# EAGLE design Maggie-BASIC-TOP (EAGLE 9.6.2)
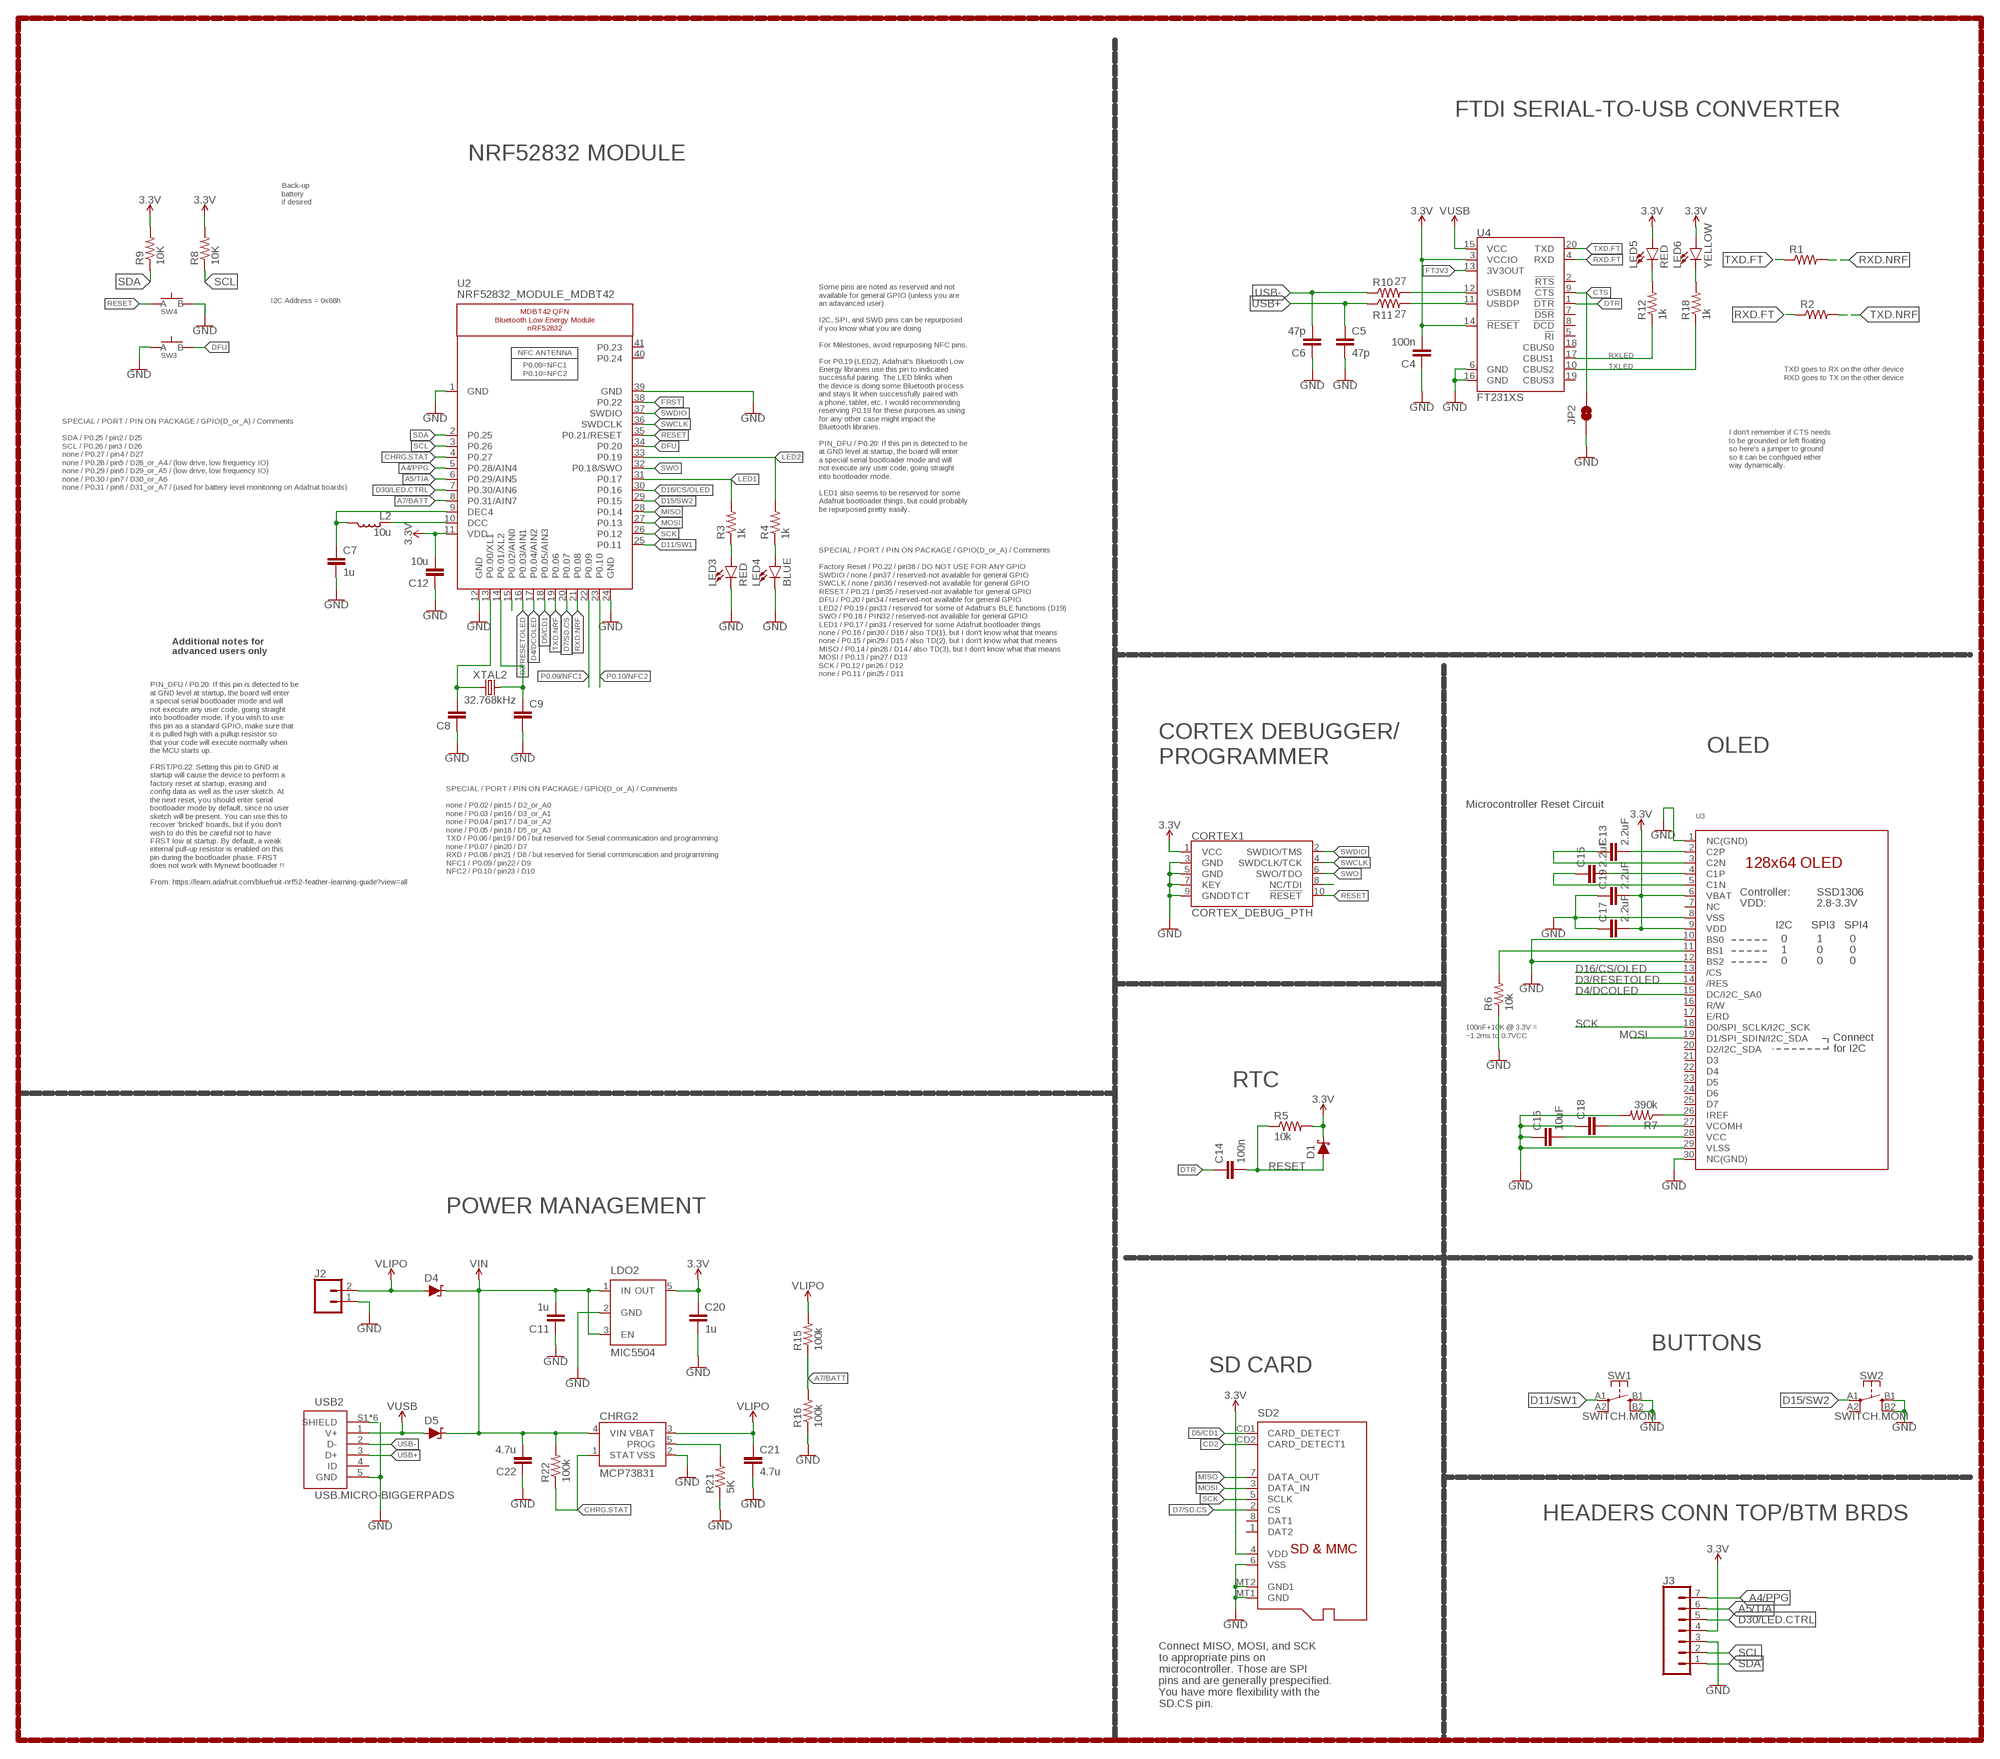
[diagram p0: schematic, sheet 1]

## Parts
C4  100n  CAPACITOR0603  [C0603]
C5  47p  CAPACITOR0603  [C0603]
C6  47p  CAPACITOR0603  [C0603]
C7  1u  CAPACITOR0603  [C0603]
C8  CAPACITOR0603  [C0603]
C9  CAPACITOR0603  [C0603]
C11  1u  CAPACITOR0603  [C0603]
C12  10u  CAPACITOR0805  [C0805]
C13  2.2uF  CAPACITOR0402  [C0402]
C14  100n  CAPACITOR0603  [C0603]
C15  2.2uF  CAPACITOR0402  [C0402]
C16  10uF  CAPACITOR0603  [C0603]
C17  2.2uF  CAPACITOR0402  [C0402]
C18  CAPACITOR0603  [C0603]
C19  2.2uF  CAPACITOR0402  [C0402]
C20  1u  CAPACITOR0603  [C0603]
C21  4.7u  CAPACITOR0603  [C0603]
C22  4.7u  CAPACITOR0603  [C0603]
CHRG2  MCP73831  [SOT23-5]
CORTEX1  CORTEX_DEBUG_PTH  [2X5-PTH-1.27MM]
D1  SCHOTTKY-USC  [USC]
D4  SCHOTTKY-USC  [USC]
D5  SCHOTTKY-USC  [USC]
J2  CONN_02  [1X02]
J3  CONN_07-1.27MM  [1X07_1.27MM]
JP2  JUMPER-SMT_2_NO_SILK  [SMT-JUMPER_2_NO_SILK]
L2  10u  INDUCTOR0603  [L0603]
LDO2  MIC5504  [SOT23-5]
LED3  RED  LED0603  [LED-0603]
LED4  BLUE  LED0603  [LED-0603]
LED5  RED  LED0603  [LED-0603]
LED6  YELLOW  LED0603  [LED-0603]
R1  RESISTOR0603  [R0603]
R2  RESISTOR0603  [R0603]
R3  1k  RESISTOR0603  [R0603]
R4  1k  RESISTOR0603  [R0603]
R5  10k  RESISTOR0603  [R0603]
R6  10k  RESISTOR0603  [R0603]
R7  390k  RESISTOR0603  [R0603]
R8  10K  RESISTOR0603  [R0603]
R9  10K  RESISTOR0603  [R0603]
R10  27  RESISTOR0603  [R0603]
R11  27  RESISTOR0603  [R0603]
R12  1k  RESISTOR0603  [R0603]
R15  100k  RESISTOR0603  [R0603]
R16  100k  RESISTOR0603  [R0603]
R18  1k  RESISTOR0603  [R0603]
R21  5K  RESISTOR0603  [R0603]
R22  100k  RESISTOR0603  [R0603]
SD2  MICROSD  [MICROSD]
SW1  SWITCH.MOM  [TACTILE_SWITCH_SMD_6.2MM_TALL]
SW2  SWITCH.MOM  [TACTILE_SWITCH_SMD_6.2MM_TALL]
SW3  SPST-PTS830GG140-COPY.1-3  [BUTTON-GULLWING]
SW4  SPST-PTS830GG140-COPY.1-3  [BUTTON-GULLWING]
U2  NRF52832_MODULE_MDBT42  [BLE_MODULE_RAYTAC_MDBT42]
U3  DISP_OLED_UG-2864HSWEG01-NO-WRAPAROUND  [UG-2864HSWEG01_0.96IN_NO-WRAPAROUND]
U4  FT231XS  [SSOP20_L]
USB2  USB.MICRO-BIGGERPADS  [USB-MICRO-01.BIGGERPADS]
XTAL2  32.768kHz  CRYSTALECS-.327-12.5-12-C-TR  [2-SMD.NOLEAD.2.0MMTO1.2MM]

## Nets
3.3: C4.2 C12.2 C17.2 C19.2 CORTEX1.1(VCC) D1.-(C) LED5.A LED6.A R5.2 R8.2 R9.2 SD2.4(VDD) U2.11(VDD) U3.6(VBAT) U3.9(VDD) U4.3(VCCIO) U4.14(!RESET) ; supply symbol labelled 3.3V
3.3V: C20.1 J3.4 LDO2.5(OUT)
A4/PPG: J3.7 U2.5(P0.28/AIN4)
A5/TIA: J3.6 U2.6(P0.29/AIN5)
A7/BATT: R15.1 R16.2 U2.8(P0.31/AIN7)
CD2: SD2.CD2(CARD_DETECT1)
CHRG.STAT: CHRG2.1(STAT) R22.1 U2.4(P0.27)
CTS: JP2.2 U4.9(!CTS)
D3/RESETOLED: U2.16(P0.03/AIN1) U3.14(/RES)
D4/DCOLED: U2.17(P0.04/AIN2) U3.15(DC/I2C_SA0)
D5/CD1: SD2.CD1(CARD_DETECT) U2.18(P0.05/AIN3)
D7/SD.CS: SD2.2(CS) U2.20(P0.07)
D11/SW1: SW1.A1 U2.25(P0.11)
D15/SW2: SW2.A1 U2.29(P0.15)
D16/CS/OLED: U2.30(P0.16) U3.13(/CS)
D30/LED.CTRL: J3.5 U2.7(P0.30/AIN6)
DFU: SW3.3(B) U2.34(P0.20)
DTR: C14.1 U4.1(!DTR)
FRST: U2.38(P0.22)
FT3V3: U4.13(3V3OUT)
GND: C4.1 C5.2 C6.1 C7.2 C8.1 C9.2 C11.1 C12.1 C16.1 C17.1 C18.1 C19.1 C20.2 C21.2 C22.1 CHRG2.2(VSS) CORTEX1.3(GND) CORTEX1.5(GND) CORTEX1.7(KEY) CORTEX1.9(GNDDTCT) J2.1 J3.3 JP2.1 LDO2.2(GND) LED3.C LED4.C R6.1 R7.2 R16.1 R21.1 SD2.6(VSS) SD2.MT1(GND) SD2.MT2(GND1) SW1.B1 SW1.B2 SW2.B1 SW2.B2 SW3.1(A) SW4.3(B) U2.1(GND) U2.12(GND) U2.24(GND) U2.39(GND) U3.1(NC(GND)) U3.8(VSS) U3.10(BS0) U3.12(BS2) U3.29(VLSS) U3.30(NC(GND)) U4.6(GND) U4.16(GND) USB2.5(GND) USB2.S1(SHIELD) USB2.S2(SHIELD) USB2.S3(SHIELD) USB2.S4(SHIELD) USB2.S5(SHIELD) USB2.S6(SHIELD)
LED1: R3.2 U2.31(P0.17)
LED2: R4.2 U2.33(P0.19)
MISO: SD2.7(DATA_OUT) U2.28(P0.14)
MOSI: SD2.3(DATA_IN) U2.27(P0.13) U3.19(D1/SPI_SDIN/I2C_SDA)
N$1: R6.2 U3.11(BS1)
N$2: R7.1 U3.26(IREF)
N$3: C13.2 U3.2(C2P)
N$4: C8.2 U2.13(P0.00/XL1) XTAL2.P$1
N$5: C13.1 U3.3(C2N)
N$6: C9.1 U2.14(P0.01/XL2) XTAL2.P$2
N$7: C15.2 U3.4(C1P)
N$8: C15.1 U3.5(C1N)
N$9: LED3.A R3.1
N$10: LED4.A R4.1
N$11: L2.1 U2.10(DCC)
N$12: C7.1 L2.2 U2.9(DEC4)
N$13: C16.2 U3.28(VCC)
N$14: CORTEX1.8(NC/TDI)
N$15: C18.2 U3.27(VCOMH)
N$17: CHRG2.5(PROG) R21.2
N$20: U2.15(P0.02/AIN0)
N$23: R10.2 U4.12(USBDM)
N$24: R11.2 U4.11(USBDP)
N$25: LED5.C R12.2
N$26: LED6.C R18.2
P0.09/NFC1: U2.22(P0.09)
P0.10/NFC2: U2.23(P0.10)
RESET: C14.2 CORTEX1.10(!RESET) D1.+(A) R5.1 SW4.1(A) U2.35(P0.21/RESET)
RXD.FT: R2.1 U4.4(RXD)
RXD.NRF: R1.2 U2.21(P0.08)
RXLED: R12.1 U4.17(CBUS1)
SCK: SD2.5(SCLK) U2.26(P0.12) U3.18(D0/SPI_SCLK/I2C_SCK)
SCL: J3.2 R8.1 U2.3(P0.26)
SDA: J3.1 R9.1 U2.2(P0.25)
SWCLK: CORTEX1.4(SWDCLK/TCK) U2.36(SWDCLK)
SWDIO: CORTEX1.2(SWDIO/TMS) U2.37(SWDIO)
SWO: CORTEX1.6(SWO/TDO) U2.32(P0.18/SWO)
TXD.FT: R1.1 U4.20(TXD)
TXD.NRF: R2.2 U2.19(P0.06)
TXLED: R18.1 U4.10(CBUS2)
USB+: C5.1 R11.1 USB2.3(D+)
USB-: C6.2 R10.1 USB2.2(D-)
V_USB: D5.+(A) U4.15(VCC) USB2.1(V+) ; supply symbol labelled VUSB
VIN: C11.2 C22.2 CHRG2.4(VIN) D4.-(C) D5.-(C) LDO2.1(IN) LDO2.3(EN) R22.2
VLIPO: C21.1 CHRG2.3(VBAT) D4.+(A) J2.2 R15.2
Unconnected: SD2.1(DAT2) SD2.8(DAT1) SW1.A2 SW2.A2 U2.40(P0.24) U2.41(P0.23) U3.7(NC) U3.16(R/W) U3.17(E/RD) U3.20(D2/I2C_SDA) U3.21(D3) U3.22(D4) U3.23(D5) U3.24(D6) U3.25(D7) U4.2(!RTS) U4.5(!RI) U4.7(!DSR) U4.8(!DCD) U4.18(CBUS0) U4.19(CBUS3) USB2.4(ID)

## Notes on the sheet
- FTDI SERIAL-TO-USB CONVERTER
- NRF52832 MODULE
- Back-up
  battery
  if desired
- I2C Address = 0x68h
- TXD goes to RX on the other device
  RXD goes to TX on the other device
- I don't remember if CTS needs
  to be grounded or left floating
  so here's a jumper to ground
  so it can be configued either
  way dynamically.
- SPECIAL / PORT / PIN ON PACKAGE / GPIO(D_or_A) / Comments
  
  SDA / P0.25 / pin2 / D25
  SCL / P0.26 / pin3 / D26
  none / P0.27 / pin4 / D27
  none / P0.28 / pin5 / D28_or_A4 / (low drive, low frequency IO)
  none / P0.29 / pin6 / D29_or_A5 / (low drive, low frequency IO)
  none / P0.30 / pin7 / D30_or_A6
  none / P0.31 / pin8 / D31_or_A7 / (used for battery level monitoring on Adafruit boards)
- Some pins are noted as reserved and not
  available for general GPIO (unless you are
  an adavanced user)
  
  I2C, SPI, and SWD pins can be repurposed
  if you know what you are doing
  
  For Milestones, avoid repurposing NFC pins.
  
  For P0.19 (LED2), Adafruit's Bluetooth Low
  Energy libraries use this pin to indicated
  successful pairing. The LED blinks when
  the device is doing some Bluetooth process
  and stays lit when successfully paired with
  a phone, tablet, etc. I would recommending
  reserving P0.19 for these purposes as using
  for any other case might impact the
  Bluetooth libraries.
  
  PIN_DFU / P0.20: If this pin is detected to be
  at GND level at startup, the board will enter
  a special serial bootloader mode and will
  not execute any user code, going straight
  into bootloader mode.
  
  LED1 also seems to be reserved for some
  Adafruit bootloader things, but could probably
  be repurposed pretty easily.
- Additional notes for
  advanced users only
- SPECIAL / PORT / PIN ON PACKAGE / GPIO(D_or_A) / Comments
  
  Factory Reset / P0.22 / pin38 / DO NOT USE FOR ANY GPIO
  SWDIO / none / pin37 / reserved-not available for general GPIO
  SWCLK / none / pin36 / reserved-not available for general GPIO
  RESET / P0.21 / pin35 / reserved-not available for general GPIO
  DFU / P0.20 / pin34 / reserved-not available for general GPIO
  LED2 / P0.19 / pin33 / reserved for some of Adafruit's BLE functions (D19)
  SWO / P0.18 / PIN32 / reserved-not available for general GPIO
  LED1 / P0.17 / pin31 / reserved for some Adafruit bootloader things
  none / P0.16 / pin30 / D16 / also TD(1), but I don't know what that means
  none / P0.15 / pin29 / D15 / also TD(2), but I don't know what that means
  MISO / P0.14 / pin28 / D14 / also TD(3), but I don't know what that means
  MOSI / P0.13 / pin27 / D13
  SCK / P0.12 / pin26 / D12
  none / P0.11 / pin25 / D11
- OLED
- CORTEX DEBUGGER/
  PROGRAMMER
- Microcontroller Reset Circuit
- SPECIAL / PORT / PIN ON PACKAGE / GPIO(D_or_A) / Comments
  
  none / P0.02 / pin15 / D2_or_A0
  none / P0.03 / pin16 / D3_or_A1
  none / P0.04 / pin17 / D4_or_A2
  none / P0.05 / pin18 / D5_or_A3
  TXD / P0.06 / pin19 / D6 / but reserved for Serial communication and programming
  none / P0.07 / pin20 / D7
  RXD / P0.08 / pin21 / D8 / but reserved for Serial communication and programming
  NFC1 / P0.09 / pin22 / D9
  NFC2 / P0.10 / pin23 / D10
- PIN_DFU / P0.20: If this pin is detected to be
  at GND level at startup, the board will enter
  a special serial bootloader mode and will
  not execute any user code, going straight
  into bootloader mode. If you wish to use
  this pin as a standard GPIO, make sure that
  it is pulled high with a pullup resistor so
  that your code will execute normally when
  the MCU starts up.
  
  FRST/P0.22: Setting this pin to GND at
  startup will cause the device to perform a
  factory reset at startup, erasing and
  config data as well as the user sketch. At
  the next reset, you should enter serial
  bootloader mode by default, since no user
  sketch will be present. You can use this to
  recover 'bricked' boards, but if you don't
  wish to do this be careful not to have
  FRST low at startup. By default, a weak
  internal pull-up resistor is enabled on this
  pin during the bootloader phase. FRST
  does not work with Mynewt bootloader !!
  
  From: https://learn.adafruit.com/bluefruit-nrf52-feather-learning-guide?view=all
- 100nF+10K @ 3.3V =
  ~1.2ms to 0.7VCC
- RTC
- POWER MANAGEMENT
- BUTTONS
- SD CARD
- HEADERS CONN TOP/BTM BRDS
- Connect MISO, MOSI, and SCK
  to appropriate pins on
  microcontroller. Those are SPI
  pins and are generally prespecified.
  You have more flexibility with the
  SD.CS pin.

## Library data of the parts
C4-C9 C11-C22 = LinnesLab-Passives:CAPACITOR
CHRG2 = LinnesLab-Power:MCP73831: MCP73831T Li-Ion, Li-Pol Controller Miniature single cell, fully integrated Li-Ion, Li-polymer charge management controller Datasheet <http://ww1.microchip.com/downloads/en/DeviceDoc/20001984g.pdf> SparkFun Products: SparkFun ESP32 Thing <https://www.sparkfun.com/products/13907> SparkFun 9DoF Razor IMU M0 <https://www.sparkfun.com/products/14001>; PROD_ID: IC-09995
CORTEX1 = LinnesLab-Connectors:CORTEX_DEBUG: Cortex Debug Connector - 10 pin Supports JTAG debug, Serial Wire debug, and Serial Wire Viewer. PTH and SMD connector options available. General Connector Information <http://infocenter.arm.com/help/topic/com.arm.doc.faqs/attached/13634/cortex_debug_connectors.pdf> Products: PTH Connector <http://www.digikey.com/product-detail/en/cnc-tech/3220-10-0100-00/1175-1627-ND/3883661> -via Digi-Key SparkFun PSoc <https://www.sparkfun.com/products/13229> SparkFun T <https://www.sparkfun.com/products/13810>
D1 D4 D5 = LinnesLab-DiscreteSemi:SCHOTTKY: Schottky diode A Schottky diode is a semiconductor diode which has a low forward voltage drop and a very fast switching action. Example: Digi-Key Part Number: RB161MM-20CT-ND
J2 = LinnesLab-Connectors:CONN_02: Multi connection point. Often used as Generic Header-pin footprint for 0.1 inch spaced/style header connections On any of the 0.1 inch spaced packages, you can populate with these: Break Away Headers - Straight <https://www.sparkfun.com/products/116> (PRT-00116) Break Away Male Headers - Right Angle <https://www.sparkfun.com/products/553> (PRT-00553) Female Headers <https://www.sparkfun.com/products/115> (PRT-00115) Break Away Headers - Machine Pin <https://www.sparkfun.com/products/117> (PRT-00117) Break Away Female Headers - Swiss Machine Pin <https://www.sparkfun.com/products/743> (PRT-00743) For SCREWTERMINALS and SPRING TERMINALS visit here: Screw Terimnals on SparkFun.com <https://www.sparkfun.com/search/results?term=Screw+Terminals> (5mm/3.5mm/2.54mm spacing) This device is also useful as a general connection point to wire up your design to another part of your project. Our various solder wires solder well into these plated through hole pads. Hook-Up Wire - Assortment (Stranded, 22 AWG) <https://www.sparkfun.com/products/11375> (PRT-11375) Hook-Up Wire - Assortment (Solid Core, 22 AWG) <https://www.sparkfun.com/products/11367> (PRT-11367) View the entire wire category on our website here <https://www.sparkfun.com/categories/141> Special notes: Molex polarized connector foot print use with: PRT-08233 with associated crimp pins and housings. 2.54_SCREWTERM for use with PRT-10571. 3.5mm Screw Terminal footprints for PRT-08084 5mm Screw Terminal footprints for use with PRT-08432
J3 = LinnesLab-Connectors:CONN_07: Multi connection point. Often used as Generic Header-pin footprint for 0.1 inch spaced/style header connections On any of the 0.1 inch spaced packages, you can populate with these: Break Away Headers - Straight <https://www.sparkfun.com/products/116> (PRT-00116) Break Away Male Headers - Right Angle <https://www.sparkfun.com/products/553> (PRT-00553) Female Headers <https://www.sparkfun.com/products/115> (PRT-00115) Break Away Headers - Machine Pin <https://www.sparkfun.com/products/117> (PRT-00117) Break Away Female Headers - Swiss Machine Pin <https://www.sparkfun.com/products/743> (PRT-00743) For SCREWTERMINALS and SPRING TERMINALS visit here: Screw Terimnals on SparkFun.com <https://www.sparkfun.com/search/results?term=Screw+Terminals> (5mm/3.5mm/2.54mm spacing) This device is also useful as a general connection point to wire up your design to another part of your project. Our various solder wires solder well into these plated through hole pads. Hook-Up Wire - Assortment (Stranded, 22 AWG) <https://www.sparkfun.com/products/11375> (PRT-11375) Hook-Up Wire - Assortment (Solid Core, 22 AWG) <https://www.sparkfun.com/products/11367> (PRT-11367) View the entire wire category on our website here <https://www.sparkfun.com/categories/141> Special notes: Molex polarized connector foot print use with SKU : PRT-08231 with associated crimp pins and housings. 1MM SMD Version SKU: PRT-10208 NOTES ON THE VARIANTS LOCK and LOCK_LONGPADS... This footprint was designed to help hold the alignment of a through-hole component (i.e. 6-pin header) while soldering it into place. You may notice that each hole has been shifted either up or down by 0.005 of an inch from it's more standard position (which is a perfectly straight line). This slight alteration caused the pins (the squares in the middle) to touch the edges of the holes. Because they are alternating, it causes a "brace" to hold the component in place. 0.005 has proven to be the perfect amount of "off-center" position when using our standard breakaway headers. Although looks a little odd when you look at the bare footprint, once you have a header in there, the alteration is very hard to notice. Also,if you push a header all the way into place, it is covered up entirely on the bottom side.
JP2 = LinnesLab-Switches:JUMPER-SMT_2_NO: Normally open jumper This jumper has two pads in close proximity to each other. Apply solder to close the connection. Round pads are easier to solder for beginners, but are a lot larger. SparkFun Product that uses the round pads: SparkFun EL Sequencer <https://www.sparkfun.com/products/12781>
L2 = LinnesLab-Passives:INDUCTOR
LDO2 = LinnesLab-Power:MIC5504: MIC5504 Voltage Regulator Output Voltages: 1.0V to 3.3V Input Voltages: 2.5V to 5.5V Link to Datasheet http://ww1.microchip.com/downloads/en/DeviceDoc/MIC550X.pdf
LED3-LED6 = LinnesLab-LED:LED: LED (Generic) Standard schematic elements and footprints for 5mm, 3mm, 1206, and 0603 sized LEDs. Generic LEDs with no color specified. LTST-C190KGKT: arrow indicates cathode
R1-R12 R15 R16 R18 R21 R22 = LinnesLab-Passives:RESISTOR
SD2 = LinnesLab-Connectors:MICROSD: Micro-SD / Transflash card holder with SPI pinout For the 3M # 2908-05WB-MG and/or 4UCON #19656 push-push type
SW1 SW2 = LinnesLab-Switches:SWITCH.MOM: PTS645SM43SMTR92 LFS
SW3 SW4 = LinnesLab-Switches:SPST-PTS830GG140-COPY
U2 = LinnesLab-Microcontrollers:NRF52832_MODULE_MDBT42: MDBT42 - BLE Module (nRF52832 QFN) VDD: 1.7-3.6V
U3 = LinnesLab-Displays:DISP_OLED_UG-2864HSWEG01: UG-2864HSWEG01 OLED display Both 1.3" and 0.96" models share the same FPC tab footprint, only the screen dimensions vary.
U4 = LinnesLab-DigitalIC:FT231X: FTDI FT231X Full Speed USB to Full-handshake UART This USB2.0 Full Speed IC offers a compact bridge to full handshake UART interfaces. The device is a UART, capable of operating up to 3MBaud, with low power consumption (8mA). The FT231X includes the complete FT-X series feature set and enables USB to be added into a system design quickly and easily over a UART interface. Datasheet <http://cdn.sparkfun.com/datasheets/Components/General%20IC/DS_FT231X.pdf>; DIGIKEY: 768-1156-5-ND; MFN: FT231XS-U
USB2 = LinnesLab-Connectors:USB.MICRO: DigiKey PN: 609-4613-1-ND
XTAL2 = LinnesLab-Clocks:CRYSTAL; DIGIKEY: XC2288CT-ND; FREQ: 32.7680KHZ; LOAD_CAP: 12.5pF

## Board
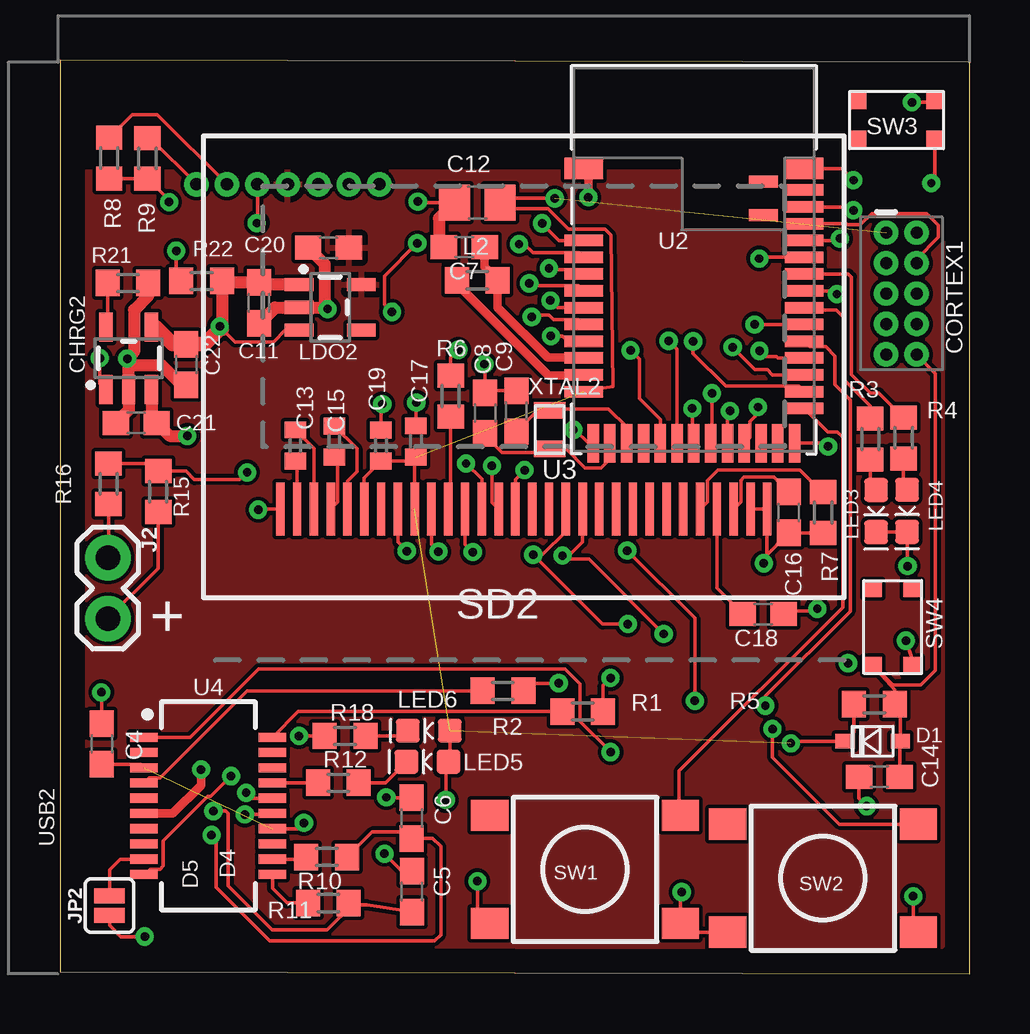
[diagram p1: board, top side]
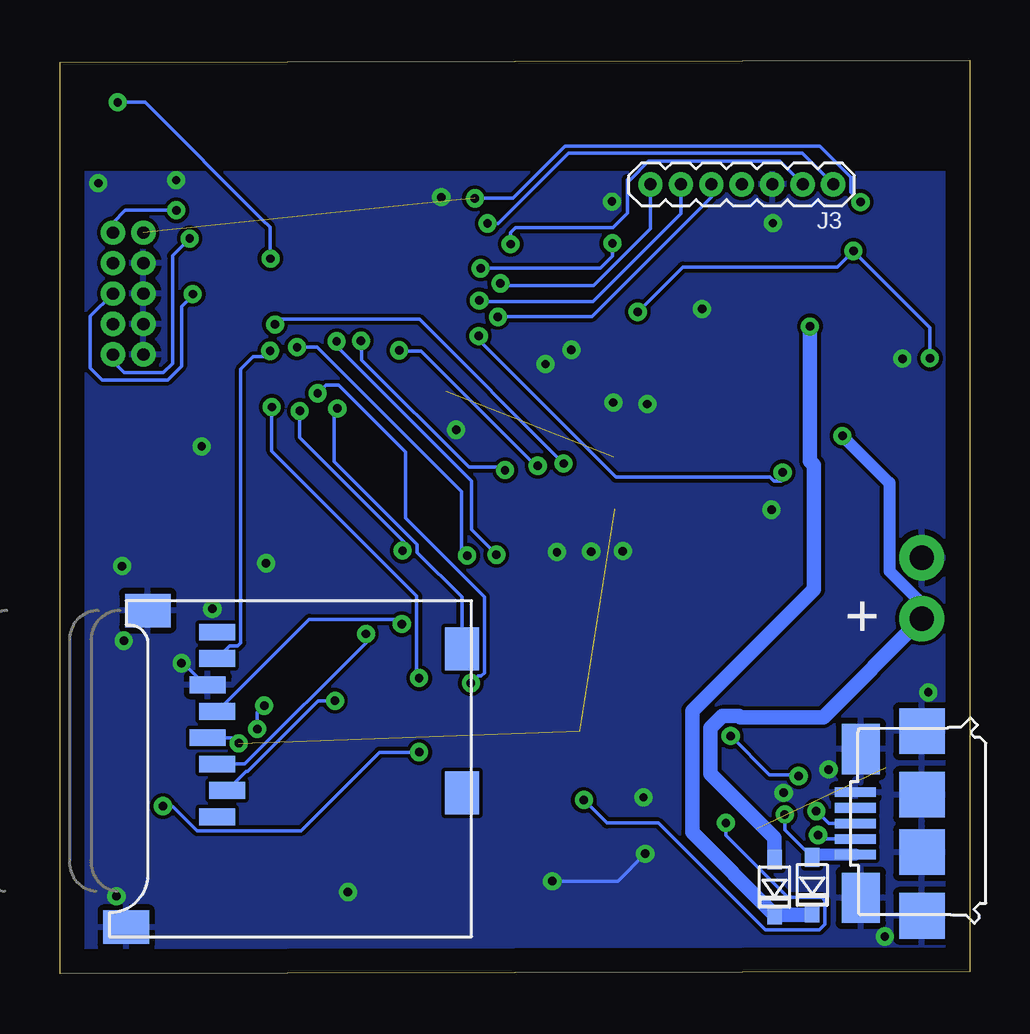
[diagram p2: board, bottom side, seen from below]

Size 37.92 x 38.1 mm. Coordinates in mm from the lower left corner, seen from the top.
Outline: 0,0.1 37.92,0 37.92,38 0,38.1 0,0.1
Copper layers (1*16): Top 0.035mm / dielectric 1.5mm / Bottom 0.035mm
Design rules "default": minimum track width 6mil, minimum drill 0.35mm, track to track 6mil, track to pad 6mil, pad to pad 6mil, via to via 6mil, smd to smd 6mil, copper to edge 40mil, drill to drill 6mil, minimum pad ring 10mil, minimum via ring 8mil, stop-mask expansion 4mil, vias tented up to drill 0mil, thermal gap 10mil

### Footprints (pad centres in the part's own frame; a part is rotated, then mirrored left to right if it is on the bottom)
C0603 = smd 1.1 x 1: 1 -0.85,0; 2 0.85,0
C0805 = smd 1.3 x 1.5: 1 -0.95,0; 2 0.95,0
C0402 = smd 0.7 x 0.9: 1 -0.65,0; 2 0.65,0
SOT23-5 = smd 0.55 x 1.2: 1 -0.95,-1.3; 2 0,-1.3; 3 0.95,-1.3; 4 0.95,1.3; 5 -0.95,1.3
2X5-PTH-1.27MM = drill 0.508 pad 1: 1 -2.54,-0.635; 2 -2.54,0.635; 3 -1.27,-0.635; 4 -1.27,0.635; 5 0,-0.635; 6 0,0.635; 7 1.27,-0.635; 8 1.27,0.635; 9 2.54,-0.635; 10 2.54,0.635
USC = smd 0.8 x 0.6: + -1.15,0; - 1.15,0
1X02 = drill 1.016 pad 1.88: 1 0,0; 2 2.54,0
1X07_1.27MM = drill 0.508 pad 1: 1 0,0; 2 1.27,0; 3 2.54,0; 4 3.81,0; 5 5.08,0; 6 6.35,0; 7 7.62,0
SMT-JUMPER_2_NO_SILK = smd 0.635 x 1.27: 1 -0.406,0; 2 0.406,0
L0603 = smd 1 x 1.1: 1 -0.85,0; 2 0.85,0
LED-0603 = smd 1 x 1: A -0.877,0; C 0.877,0
R0603 = smd 1 x 1.1: 1 -0.85,0; 2 0.85,0
MICROSD = smd 0.7 x 1.5: 1 9,-10.64; 2 7.9,-10.24; 3 6.8,-10.64; 4 5.7,-11.04; 5 4.6,-10.64; 6 3.5,-11.04; 7 2.4,-10.64; 8 1.3,-10.64 | smd 1.8 x 1.4: CD1 2,-0.44; CD2 8,-0.44 | smd 1.4 x 1.9: MT1 0.4,-13.54; MT2 13.6,-14.44
TACTILE_SWITCH_SMD_6.2MM_TALL = smd 1.55 x 1.3: A1 -3.975,-2.25; A2 3.975,-2.25; B1 -3.975,2.25; B2 3.975,2.25
BUTTON-GULLWING = smd 0.7 x 0.75: 1 -1.6,0.825; 2 1.6,0.825; 3 -1.6,-0.825; 4 1.6,-0.825
BLE_MODULE_RAYTAC_MDBT42 = smd 1.6 x 0.9: 1 -4.6,3.8; 39 4.6,3.8 | smd 1.6 x 0.48: 2 -4.6,0.8; 3 -4.6,0.1; 4 -4.6,-0.6; 5 -4.6,-1.3; 6 -4.6,-2; 7 -4.6,-2.7; 8 -4.6,-3.4; 9 -4.6,-4.1; 10 -4.6,-4.8; 11 -4.6,-5.5; 25 4.6,-6.2; 26 4.6,-5.5; 27 4.6,-4.8; 28 4.6,-4.1; 29 4.6,-3.4; 30 4.6,-2.7; 31 4.6,-2; 32 4.6,-1.3; 33 4.6,-0.6; 34 4.6,0.1; 35 4.6,0.8; 36 4.6,1.5; 37 4.6,2.2; 38 4.6,2.9 | smd 0.48 x 1.6: 12 -4.2,-7.65; 13 -3.5,-7.65; 14 -2.8,-7.65; 15 -2.1,-7.65; 16 -1.4,-7.65; 17 -0.7,-7.65; 18 0,-7.65; 19 0.7,-7.65; 20 1.4,-7.65; 21 2.1,-7.65; 22 2.8,-7.65; 23 3.5,-7.65; 24 4.2,-7.65 | smd 1.2 x 0.5: 40 2.9,3.25; 41 2.9,1.85
UG-2864HSWEG01_0.96IN_NO-WRAPAROUND = smd 0.35 x 2.2: 1 -10.15,-1.2; 2 -9.45,-1.2; 3 -8.75,-1.2; 4 -8.05,-1.2; 5 -7.35,-1.2; 6 -6.65,-1.2; 7 -5.95,-1.2; 8 -5.25,-1.2; 9 -4.55,-1.2; 10 -3.85,-1.2; 11 -3.15,-1.2; 12 -2.45,-1.2; 13 -1.75,-1.2; 14 -1.05,-1.2; 15 -0.35,-1.2; 16 0.35,-1.2; 17 1.05,-1.2; 18 1.75,-1.2; 19 2.45,-1.2; 20 3.15,-1.2; 21 3.85,-1.2; 22 4.55,-1.2; 23 5.25,-1.2; 24 5.95,-1.2; 25 6.65,-1.2; 26 7.35,-1.2; 27 8.05,-1.2; 28 8.75,-1.2; 29 9.45,-1.2; 30 10.15,-1.2
SSOP20_L = smd 0.381 x 1.143: 1 -2.857,-2.68; 2 -2.223,-2.68; 3 -1.587,-2.68; 4 -0.953,-2.68; 5 -0.318,-2.68; 6 0.318,-2.68; 7 0.953,-2.68; 8 1.587,-2.68; 9 2.223,-2.68; 10 2.857,-2.68; 11 2.857,2.68; 12 2.223,2.68; 13 1.587,2.68; 14 0.953,2.68; 15 0.318,2.68; 16 -0.318,2.68; 17 -0.953,2.68; 18 -1.587,2.68; 19 -2.223,2.68; 20 -2.857,2.68
USB-MICRO-01.BIGGERPADS = smd 0.4 x 1.7: 1 -1.3,1.505; 2 -0.65,1.505; 3 0,1.505; 4 0.65,1.505; 5 1.3,1.505 | smd 1.9 x 1.9: S1 -3.85,-1.27; S2 -1.2,-1.27; S3 1.2,-1.27; S4 3.85,-1.27 | smd 2.1 x 1.6: S5 -3.1,1.28; S6 3.1,1.28
2-SMD.NOLEAD.2.0MMTO1.2MM = smd 0.7 x 1.3: P$1 -0.8,0; P$2 0.8,0

### Placement (x,y rotation side)
C4  1.74,9.59 270 top
C5  14.68,3.44 90 top
C6  14.66,6.5 270 top
C7  16.85,30.3 180 top
C8  17.72,23.38 270 top
C9  19.02,23.46 90 top
C11  8.3,27.98 90 top
C12  17.4,32.15 0 top
C13  9.81,22.03 270 top
C14  34.16,8.22 0 top
C15  11.44,22.19 270 top
C16  30.39,19.25 90 top
C17  14.84,22.2 270 top
C18  29.31,15 180 top
C19  13.38,22.03 270 top
C20  11.19,30.28 180 top
C21  3.18,22.97 180 top
C22  5.27,25.4 90 top
CHRG2  2.87,25.66 0 top
CORTEX1  35.08,28.36 270 top
D1  33.88,9.7 180 top
D4  8.13,3.62 270 bottom
D5  6.57,3.71 270 bottom
J2  2,17.35 270 top
J3  5.69,32.92 180 bottom
JP2  2.07,2.85 90 top
L2  17.4,28.92 0 top
LDO2  11.26,27.79 270 top
LED3  34.02,19.3 270 top
LED4  35.32,19.31 270 top
LED5  15.32,8.85 180 top
LED6  15.37,10.14 180 top
R1  21.8,10.94 0 top
R2  18.46,11.8 0 top
R3  33.77,22.3 90 top
R4  35.17,22.35 90 top
R5  33.95,11.24 180 top
R6  16.28,24.09 270 top
R7  31.81,19.24 270 top
R8  2.05,34.01 270 top
R9  3.65,34 270 top
R10  11.12,4.88 180 top
R11  11.19,2.96 180 top
R12  11.61,7.97 0 top
R15  4.1,20.11 270 top
R16  2.03,20.43 90 top
R18  11.89,9.92 0 top
R21  2.83,28.81 180 top
R22  5.9,28.89 0 top
SD2  20.72,15.55 270 bottom
SW1  21.89,4.36 180 top
SW2  31.81,4 180 top
SW3  34.87,35.6 180 top
SW4  34.71,14.46 90 top
U2  26.43,29.78 0 top
U3  19.33,20.58 0 top
U4  6.18,7.01 270 top
USB2  3.26,6.27 90 bottom
XTAL2  20.41,22.69 90 top

### Tracks (layer width: path | path; a pad name or v marks a point on that pad's centre or on a via)
3.3  (via drill 0.35)  (5 unrouted)
  Top 0.152: U3.9 14.78,21.5 C17.2 14.67,21.38 C19.2 12.68,20.68 U3.6 | C4.2 3.36,8.74 U4.3 | R8.2 3.63,33.16 R9.2 4.55,32.25 v4.55,32.18 | R5.2 33.1,10.07 D1.- 30.55,9.7 v30.47,9.62 | LED6.A 16.25,8.9 LED5.A 16.09,8.74 v16.09,7.25 | U4.14 9.93,6.06 v10.16,6.3 | U2.11 21.85,24.3 23.05,24.5 22.96,30.8 22.72,31.05 21.2,31.05 20.35,31.89 18.61,31.89 C12.2 18.53,32.33 v20.63,32.33
  Bottom 0.152: v16.09,7.25 15.13,6.3 12.98,6.3 8.53,1.84 6.26,1.84 6.03,2.07 6.03,3.05 6.17,3.19 7.57,3.19 10.16,5.78 v10.16,6.3 | v30.47,9.62 30.7,9.85 SD2.4 | v20.63,32.33 19.04,32.33 16.86,34.51 6.24,34.51 4.95,33.22 4.95,32.58 v4.55,32.18
3.3V
  pour Top: 1.11,33.46 37.52,33.46 37.52,1.85 36.6,0.93 1.1,0.93 1.1,33.48
A4/PPG  (via drill 0.35)
  Top 0.152: U2.5 21.61,28.69 19.66,28.69 v19.57,28.79
  Bottom 0.152: v19.57,28.79 19.47,28.69 15.68,28.69 13.31,31.07 J3.7
A5/TIA  (via drill 0.35)
  Top 0.152: U2.6 20.74,27.78 v20.44,28.08
  Bottom 0.152: v20.44,28.08 20.16,28.08 20.11,28.03 15.71,28.03 12.04,31.7 J3.6
A7/BATT  (via drill 0.35)
  Top 0.152: R16.2 3.77,21.28 R15.1 5.25,20.96 5.6,20.6 7.5,20.6 v7.8,20.91 | v20.46,26.6 20.94,26.6 21.16,26.38 U2.8
  Bottom 0.152: v7.8,20.91 7.8,20.6 7.86,20.55 8.16,20.55 8.32,20.71 14.75,20.71 20.46,26.42 v20.46,26.6
CHRG.STAT  (via drill 0.35)
  Top 0.152: R22.1 4.85,29.09 v4.85,30.14 | v1.66,25.67 1.66,24.62 CHRG2.1 | U2.4 21.65,29.36 20.44,29.36 v20.39,29.41 | v14.89,30.46 13.53,29.1 13.53,27.9 13.83,27.6 v13.84,27.6
  Bottom 0.152: v1.66,25.67 1.66,26.95 v4.85,30.14 5.51,29.48 11.96,29.48 v13.84,27.6 | v20.39,29.41 20.39,29.19 20.15,29.43 15.39,29.43 14.89,29.93 v14.89,30.46
CTS
  Top 0.152: JP2.2 2.06,4.34 2.52,4.79 U4.9
D3/RESETOLED  (via drill 0.35)
  Top 0.152: v18.01,21.19 18.01,19.66 U3.14 | v23.78,25.99 24.15,25.63 24.15,23.99 25.03,23.12 U2.16
  Bottom 0.152: v18.01,21.19 18.1,21.19 22.88,25.96 23.78,25.96 v23.78,25.99
D4/DCOLED  (via drill 0.35)
  Top 0.152: U2.17 25.73,26.04 v25.37,26.39 | v19.37,21.01 18.98,20.62 U3.15
  Bottom 0.152: v25.37,26.39 25.34,26.36 25.34,25.6 20.88,21.14 19.37,21.14 v19.37,21.01
D5/CD1  (via drill 0.35)
  Top 0.152: v26.36,23.57 26.36,22.19 U2.18
  Bottom 0.152: SD2.CD1 21.16,15.71 23.04,17.58 23.04,17.91 26.49,21.36 26.49,23.51 26.43,23.51 v26.36,23.57
D7/SD.CS  (via drill 0.35)
  Top 0.152: U2.20 27.83,23.37 v27.93,23.47 | v26.46,11.39 26.46,14.83 v23.64,17.65
  Bottom 0.152: SD2.2 30.17,8.45 30.09,8.45 27.15,11.39 v26.46,11.39 | v27.93,23.47 27.93,22.37 23.51,17.95 23.51,17.87 23.64,17.74 v23.64,17.65
D11/SW1
  Top 0.152: U2.25 32,22.6 32.41,22.6 32.63,22.38 32.63,15.28 25.81,8.46 25.81,6.66 SW1.A1
D15/SW2  (via drill 0.35)
  Top 0.152: U2.29 31.26,26.14 31.92,26.14 32.3,25.76 32.3,24.57 32.95,23.93 32.95,15.12 29.41,11.58 v29.41,11.19 | SW2.A1 32.49,6.25 29.7,9.04 v29.7,10.21
  Bottom 0.152: v29.41,11.19 29.7,10.89 v29.7,10.21
D16/CS/OLED  (via drill 0.35)
  Top 0.152: U3.13 17.58,20.62 v16.93,21.28 | v28.96,27.08 | v28.96,27.08 U2.30
  Bottom 0.152: v16.93,21.28 22.94,27.29 28.74,27.29 v28.96,27.08
D30/LED.CTRL  (via drill 0.35)
  Top 0.152: U2.7 21.62,27.28 20.57,27.28 20.39,27.46 19.74,27.46 v19.67,27.39
  Bottom 0.152: v19.67,27.39 19.65,27.41 15.74,27.41 10.77,32.38 J3.5
DFU  (via drill 0.35)
  Top 0.152: SW3.3 36.39,36.34 v35.52,36.34 | v29.15,29.82 29.2,29.88 U2.34
  Bottom 0.152: v29.15,29.82 29.17,29.84 29.17,31.13 29.49,31.45 34.37,36.34 v35.52,36.34
DTR  (via drill 0.35)
  Top 0.152: U4.1 5.43,9.87 8.28,12.73 21.04,12.73 21.67,12.1 21.67,10.54 v22.96,9.25 v22.95,9.25 | v33.63,7 33.31,7.32 C14.1
  Bottom 0.152: v22.95,9.25 24.6,9.25 27.88,5.97 32.21,5.97 33.2,6.97 33.63,6.97 v33.63,7
GND  (via drill 0.35)
  Top 0.152: C7.2 15.88,30.43 | U3.1 8.29,19.38 v8.26,19.36 | v13.44,23.76 13.38,23.7 C19.1 | C17.1 14.84,23.81 v14.85,23.82 | U3.8 14.08,18.01 v14.46,17.63 | v16.6,26.02 16.28,25.7 R6.1 | U3.30 29.46,19.36 | 29.46,19.36 29.46,17.24 v29.34,17.12 29.34,17.35 C16.1 30.39,18.39 R7.2 | U3.10 15.48,17.9 v15.78,17.61 | U3.12 16.88,17.91 v17.21,17.58 | C5.2 14.25,4.29 v13.53,5.01 | C6.1 13.82,7.35 13.78,7.38 13.62,7.38 v13.6,7.36 | R16.1 2.03,17.38 J2.1 | C9.2 17.8,24.31 C8.1 17.72,25.39 v17.69,25.42 | U2.12 22.04,22.13 21.48,22.68 v21.41,22.68 | SW4.3 35.54,13.12 v35.26,13.9 v35.27,13.9 | LED3.C LED4.C 35.33,18.42 v35.33,17.01 v35.33,17 | SW2.B1 35.57,1.96 v35.57,3.24 | SW2.B2 26.23,1.75 SW1.B1 25.87,3.37 v25.92,3.42 | U2.24 31.88,22.13 v32.02,21.99 | SW3.1 36.47,33.12 v36.32,32.97 | U2.39 32.59,33.58 v33.08,33.09 | C18.1 30.29,15.13 31.57,15.13 v31.57,15.22 | v3.54,1.56 2.54,1.56 2.06,2.04 JP2.1 | C12.1 14.96,32.15 v14.91,32.2 | C4.1 1.74,11.71 v1.71,11.73 v1.73,11.74 | U4.16 7.99,7.33 v7.76,7.56 | U3.29 29.43,19.38 29.46,19.36 | J3.3 8.23,31.33 v8.2,31.3 | SW1.B2 17.4,2.62 v17.4,3.87 | U2.1 22.03,33.38
  Top 0.356: U4.6 4.71,6.69 5.88,7.87 v5.88,8.52 | 22.03,33.38 v22.03,32.38
  Top 0.508: C7.2 15.8,30.51 15.8,31.5 C12.1 | 2.87,25.59 CHRG2.2 2.87,23.51 C21.2 | 2.87,25.59 v2.81,25.65 3.09,25.93 3.09,27.68 3.68,28.28 R21.1 | 2.87,25.59 3.09,25.37 4.26,25.37 5.08,24.55 C22.1 | C11.1 8.97,27.79 LDO2.2 11.03,27.79 11.03,27.84 | 11.03,27.84 v11.16,27.72 | C20.2 11.03,29.58 11.03,27.84
  Bottom 0.152: SD2.6 31.86,12.05 32.77,12.95 v32.85,12.95 | v17.4,3.87 14.67,3.87 v13.53,5.01
  pour Bottom: 0.11,33.41 37.82,33.41 37.82,0.12 0.1,0.12 0.1,33.39 0.11,33.39
LED1
  Top 0.152: R3.2 33.77,23.68 32.65,24.8 32.65,27.38 32.36,27.68 31.13,27.68 U2.31
LED2
  Top 0.152: R4.2 34.14,24.22 33.77,24.22 33,24.99 33,29.05 32.87,29.18 U2.33
MISO  (via drill 0.35)
  Top 0.152: U2.28 29.92,25.68 29.87,25.73 29.41,25.73 v29.16,25.98
  Bottom 0.152: v29.16,25.98 29.41,25.73 29.87,25.73 30.38,25.21 30.38,13.8 30.52,13.67 30.84,13.67 SD2.7
MOSI  (via drill 0.35)
  Top 0.152: U3.19 21.78,18 21.22,17.44 v20.95,17.44 21.1,17.29 22.05,17.29 v25.17,14.18 | v28.04,26.13 28.98,25.19 29.49,25.19 29.71,24.98 U2.27
  Bottom 0.152: v28.04,26.13 27.2,26.13 21.18,20.11 21.18,17.67 v20.95,17.44 | SD2.3 30.22,8.75 25.17,13.8 v25.17,14.18
N$1
  Top 0.152: R6.2 16.28,20.49 16.16,20.37 16.16,19.4 U3.11
N$2
  Top 0.152: U3.26 26.98,19.68 26.98,20.58 27.42,21.02 30.84,21.02 31.77,20.09 R7.1
N$3
  Top 0.152: C13.2 9.88,21.31 U3.2
N$4
  Top 0.152: C8.2 17.72,22.45 18.44,21.73 20.41,21.73 XTAL2.P$1 21.09,21.89 21.89,21.1 22.56,21.1 22.92,21.46 U2.13
N$5
  Top 0.152: U3.3 10.58,21.91 C13.1
N$6
  Top 0.152: C9.1 19.9,23.5 XTAL2.P$2 20.47,23.55 22.86,23.55 23.63,22.79 U2.14
N$7
  Top 0.152: U3.4 11.58,19.68 11.58,21.4 C15.2
N$8
  Top 0.152: U3.5 11.98,20.55 12.37,20.94 12.37,21.9 C15.1
N$9
  Top 0.152: R3.1 33.77,20.42 LED3.A
N$10
  Top 0.152: R4.1 35.17,20.33 LED4.A
N$11
  Top 0.356: L2.1 16.55,28.75 20.36,24.94 21.79,24.94 U2.10
N$12
  Top 0.356: U2.9 20.34,25.69 18.25,27.77 L2.2 17.7,29.46 C7.1
N$13
  Top 0.152: U3.28 28.38,19.68 28.38,20.58 28.51,20.71 29.75,20.71 30.37,20.1 C16.2
N$15
  Top 0.152: C18.2 27.38,16.08 U3.27
N$17
  Top 0.152: R21.2 1.98,27.03 CHRG2.5
N$23
  Top 0.152: U4.12 10.18,4.79 R10.2
N$24
  Top 0.152: R11.2 9.47,2.96 8.86,3.56 U4.11
N$25
  Top 0.152: R12.2 13.57,7.97 LED5.C
N$26
  Top 0.152: R18.2 14.28,9.92 LED6.C
RESET  (via drill 0.35)
  Top 0.152: C14.2 35.01,9.68 D1.+ 35.03,11.01 R5.1 34.8,11.84 SW4.1 34.71,12.04 35.89,12.04 36.5,12.64 36.5,25.03 CORTEX1.10 | U2.35 32.43,30.58 v32.52,30.66
  Bottom 0.152: CORTEX1.10 35.71,25.54 35.25,25.07 33.62,25.07 33.24,25.45 33.24,29.94 v32.52,30.66
RXD.FT
  Top 0.152: U4.4 3.72,8.18 4.17,8.18 7.79,11.8 R2.1
RXD.NRF  (via drill 0.35)
  Top 0.152: R1.2 22.65,12.03 v22.95,12.34 | U2.21 28.76,22.36 28.76,23.02 29.1,23.36 v29.1,23.64
  Bottom 0.152: v22.95,12.34 23.05,12.44 23.05,15.75 29.1,21.8 v29.1,23.64
RXLED
  Top 0.152: U4.17 R12.1
SCK  (via drill 0.35)
  Top 0.152: U3.18 21.08,18.45 20.12,17.48 v19.73,17.48 22.62,14.59 v23.67,14.59 | U2.26 30.8,24.5 27.75,24.5 26.39,25.86 v26.39,26.37
  Bottom 0.152: v19.73,17.48 20.78,18.53 20.78,20.55 26.39,26.17 v26.39,26.37 | SD2.5 27.53,14.78 23.76,14.78 23.67,14.69 v23.67,14.59
SCL  (via drill 0.35)
  Top 0.152: U2.3 21.64,30.06 19.71,30.06 19.35,30.42 v19.14,30.42 | J3.2 4.05,35.83 3.02,35.83 R8.1
  Bottom 0.152: v19.14,30.42 19.14,30.91 18.94,31.1 14.88,31.1 14.27,31.71 14.27,33.12 14.15,33.12 13.4,33.87 7.91,33.87 J3.2
SDA  (via drill 0.35)
  Top 0.152: U2.2 20.81,30.58 v20.1,31.29 | J3.1 3.76,34.85 R9.1
  Bottom 0.152: v20.1,31.29 19.65,31.29 16.74,34.21 6.98,34.21 J3.1
SWCLK
  Top 0.152: U2.36 32.78,31.28 32.82,31.23 33.37,31.23 33.83,31.69 36.14,31.69 36.62,31.21 36.62,30.71 35.71,29.8 CORTEX1.4
SWDIO  (via drill 0.35)
  Top 0.152: U2.37 32.94,31.98 v33.08,31.84
  Bottom 0.152: v33.08,31.84 35.21,31.84 35.71,31.33 CORTEX1.2
SWO  (via drill 0.35)
  Top 0.152: U2.32 32.25,28.48 v32.39,28.34
  Bottom 0.152: v32.39,28.34 32.39,28.29 32.85,27.82 32.85,25.35 33.44,24.76 36.17,24.76 36.66,25.25 36.66,27.42 CORTEX1.6
TXD.FT
  Top 0.152: R1.1 9.93,10.94 U4.20
TXD.NRF  (via drill 0.35)
  Top 0.152: R2.2 19.63,12.12 v20.79,12.12 | v27.18,24.2 27.18,22.85 27.13,22.79 U2.19
  Bottom 0.152: v27.18,24.2 26.84,24.55 26.31,24.55 23.52,21.77 23.52,19.01 20.23,15.72 20.23,12.55 20.37,12.42 20.49,12.42 v20.79,12.12
TXLED  (via drill 0.35)
  Top 0.152: U4.10 3.53,4.13 3.77,4.37 4.17,4.37 4.3,4.5 4.3,5.55 6.15,7.4 6.28,7.4 v7.13,8.25 | R18.1 v9.97,9.92 v9.96,9.92
  Bottom 0.152: v9.96,9.92 8.34,8.3 7.13,8.3 v7.13,8.25
USB+  (via drill 0.35)
  Top 0.152: 12.19,2.89 12.79,2.89 C5.1 | 12.19,2.89 12.11,2.89 R11.1 | v6.4,6.79 6.9,6.79 7,6.69 7,3.68 8.84,1.84 11.14,1.84 12.19,2.89
  Bottom 0.152: USB2.3 5.88,6.27 v6.4,6.79
USB-  (via drill 0.35)
  Top 0.152: R10.1 13.01,5.92 14.39,5.92 C6.2 15.54,5.65 15.87,5.31 15.87,1.64 15.62,1.39 8.73,1.39 6.52,3.6 6.52,5.59 v6.32,5.79
  Bottom 0.152: USB2.2 6.15,5.62 v6.32,5.79
V_USB  (via drill 0.35)
  Top 0.152: U4.15 8.82,6.65 v7.71,6.65
  Bottom 0.152: D5.+ 7.71,6 v7.71,6.65
  Bottom 0.508: USB2.1 6.61,4.97 D5.+
VIN  (via drill 0.35)
  Top 0.152: LDO2.3 9.39,26.84 8.9,26.35 7.3,26.35 6.79,26.86 6.7,26.95
  Top 0.508: LDO2.1 8.39,28.74 C11.2 6.81,28.83 R22.2 6.75,26.9 6.79,26.86
  Top 0.61: CHRG2.4 3.98,26.96 4.69,26.25 C22.2 6.03,26.25 6.7,26.92 6.7,26.95 v6.66,26.99
  Bottom 0.61: v6.66,26.99 6.66,21.39 6.49,21.22 6.49,16.04 11.56,10.97 11.56,5.9 D4.- 6.65,2.47 D5.-
VLIPO  (via drill 0.35)
  Top 0.152: R15.2 4.1,16.91 J2.2
  Top 0.508: CHRG2.3 3.82,23.19 C21.1 4.58,22.43 v5.31,22.43
  Bottom 0.508: J2.2 2,15.45 3.34,16.79 3.34,20.47 v5.31,22.43
  Bottom 0.61: J2.2 6.11,10.7 9.57,10.7 9.62,10.75 10.31,10.75 10.8,10.27 10.8,8.34 8.13,5.67 D4.+

### Text on the board
tNames: +
bNames: +